# Altium schematic sheet CRSC0002.SchDoc
size A3; PageSetup: Record=PageOptions|CenterHorizontal=True|CenterVertical=True|PrintScale=0.73|XCorrection=1.00|YCorrection=1.00|PrintKind=1|BorderSize=5000000|LeftOffset=0|BottomOffset=0|Orientation=2|PaperLength=2970|PaperWidth=2100|Scale=100|PaperSource=15|PrintQuality=1200|MediaType=1|DitherType=10|PaperKind=A4|PrintScaleMode=1
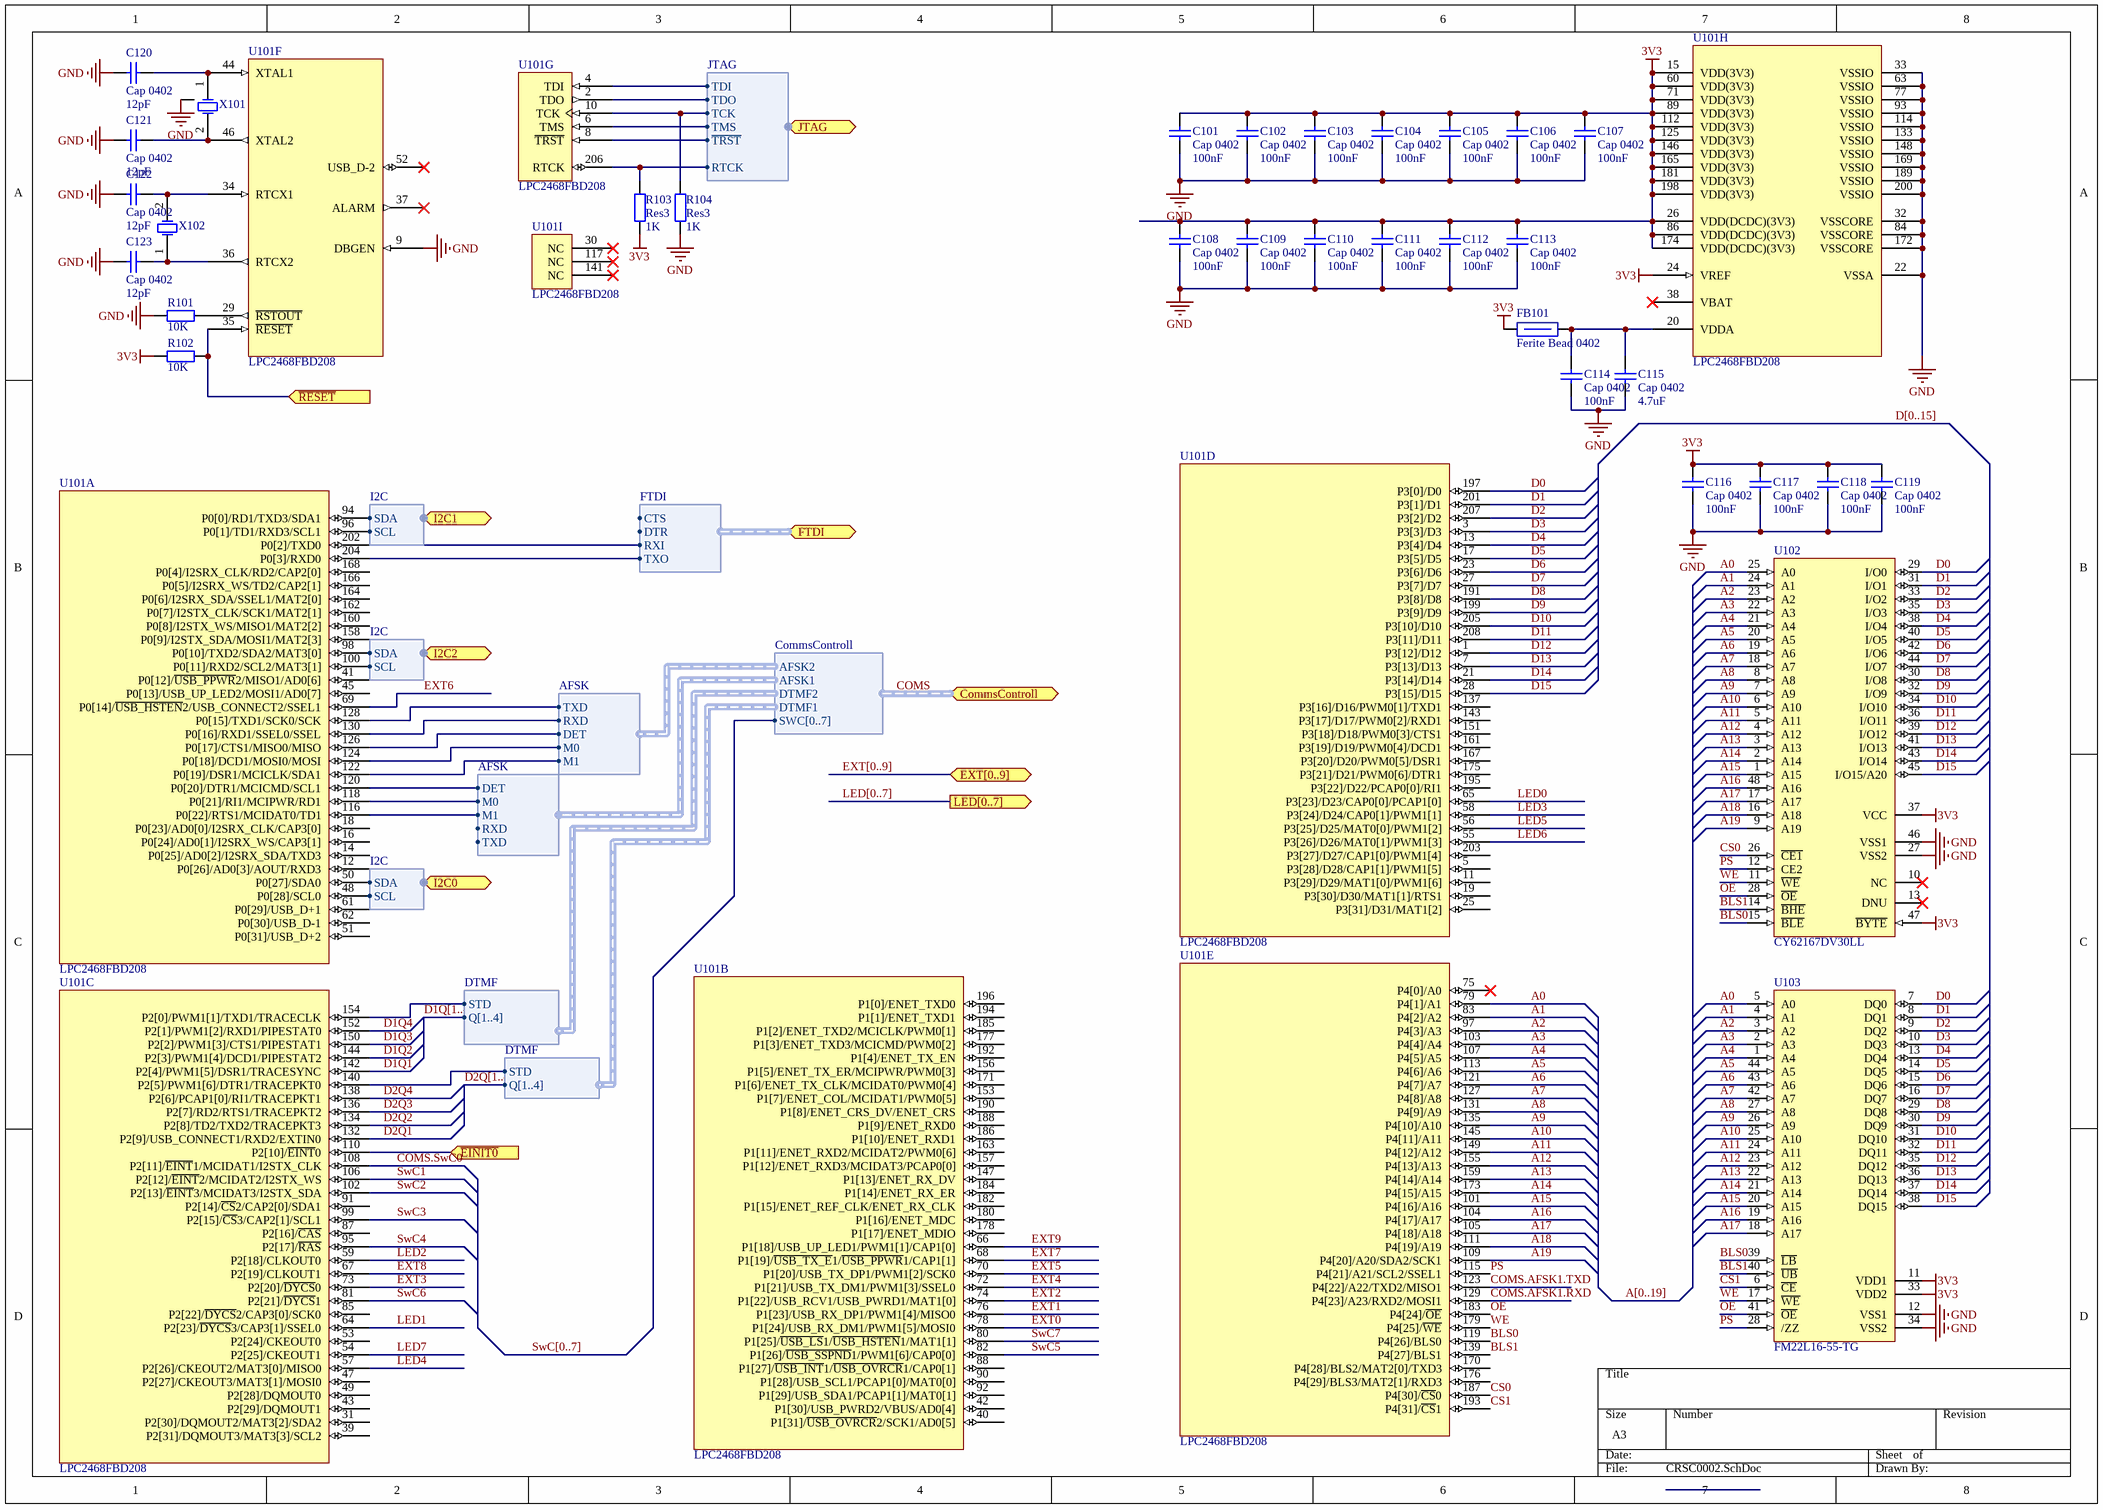
[diagram p0: CRSC0002.SchDoc]

## Parts
C101  Cap 0402  value 100nF  [CAPC1005X06L]
C102  Cap 0402  value 100nF  [CAPC1005X06L]
C103  Cap 0402  value 100nF  [CAPC1005X06L]
C104  Cap 0402  value 100nF  [CAPC1005X06L]
C105  Cap 0402  value 100nF  [CAPC1005X06L]
C106  Cap 0402  value 100nF  [CAPC1005X06L]
C107  Cap 0402  value 100nF  [CAPC1005X06L]
C108  Cap 0402  value 100nF  [CAPC1005X06L]
C109  Cap 0402  value 100nF  [CAPC1005X06L]
C110  Cap 0402  value 100nF  [CAPC1005X06L]
C111  Cap 0402  value 100nF  [CAPC1005X06L]
C112  Cap 0402  value 100nF  [CAPC1005X06L]
C113  Cap 0402  value 100nF  [CAPC1005X06L]
C114  Cap 0402  value 100nF  [CAPC1005X06L]
C115  Cap 0402  value 4.7uF  [CAPC1005X06L]
C116  Cap 0402  value 100nF  [CAPC1005X06L]
C117  Cap 0402  value 100nF  [CAPC1005X06L]
C118  Cap 0402  value 100nF  [CAPC1005X06L]
C119  Cap 0402  value 100nF  [CAPC1005X06L]
C120  Cap 0402  value 12pF  [CAPC1005X06L]
C121  Cap 0402  value 12pF  [CAPC1005X06L]
C122  Cap 0402  value 12pF  [CAPC1005X06L]
C123  Cap 0402  value 12pF  [CAPC1005X06L]
FB101  Ferite Bead 0402  [INDC1005X06L]
R101  value 10K  [RESC1005X06L]  (hidden comment: Res3)
R102  value 10K  [RESC1005X06L]  (hidden comment: Res3)
R103  Res3  value 1K  [RESC1005X06L]
R104  Res3  value 1K  [RESC1005X06L]
U101  LPC2468FBD208  [TSQFP50P3000X3000X160-208L]  (parts A,B,C,D,E,F,G,H,I of 9)
U102  CY62167DV30LL  [TSSOP50P2000X120-48L]
U103  FM22L16-55-TG  [TSOP80P1180X120-44L]
X101  Crystal Oscilator  [7M]  (value not drawn)
X102  Crystal Oscilator  [9H T10]  (value not drawn)

## Ports
CommsControll (harness CommsControll), EXT[0..9] (bidir), FTDI (harness FTDI), I2C0 (harness I2C), I2C1 (harness I2C), I2C2 (harness I2C), JTAG (harness JTAG), LED[0..7] (out), ~{EINIT0} (in), ~{RESET} (in)

## Harnesses
I2C: SDA, SCL
JTAG: TDI, TDO, TCK, TMS, ~{TRST}, RTCK
AFSK: DET, M0, M1, RXD, TXD
DTMF: Q[1..4], STD
CommsControll: AFSK1, AFSK2, DTMF1, DTMF2, SWC[0..7]
FTDI: CTS, DTR, RXI, TXO

## Nets
3V3: C101.2 C102.2 C103.2 C104.2 C105.2 C106.2 C107.2 C108.2 C109.2 C110.2 C111.2 C112.2 C113.2 C116.2 C117.2 C118.2 C119.2 FB101.1 R102.2 R103.2 U101.15(VDD(3V3)) U101.24(VREF) U101.26(VDD(DCDC)(3V3)) U101.60(VDD(3V3)) U101.71(VDD(3V3)) U101.86(VDD(DCDC)(3V3)) U101.89(VDD(3V3)) U101.112(VDD(3V3)) U101.125(VDD(3V3)) U101.146(VDD(3V3)) U101.165(VDD(3V3)) U101.174(VDD(DCDC)(3V3)) U101.181(VDD(3V3)) U101.198(VDD(3V3)) U102.37(VCC) U102.47(~{BYTE}) U103.11(VDD1) U103.33(VDD2)
GND: C101.1 C102.1 C103.1 C104.1 C105.1 C106.1 C107.1 C108.1 C109.1 C110.1 C111.1 C112.1 C113.1 C114.1 C115.1 C116.1 C117.1 C118.1 C119.1 C120.2 C121.1 C122.2 C123.1 R101.2 R104.2 U101.9(DBGEN) U101.22(VSSA) U101.32(VSSCORE) U101.33(VSSIO) U101.63(VSSIO) U101.77(VSSIO) U101.84(VSSCORE) U101.93(VSSIO) U101.114(VSSIO) U101.133(VSSIO) U101.148(VSSIO) U101.169(VSSIO) U101.172(VSSCORE) U101.189(VSSIO) U101.200(VSSIO) U102.27(VSS2) U102.46(VSS1) U103.12(VSS1) U103.34(VSS2) X101.3
A0: U101.79(P4[1]/A1) U102.25(A0) U103.5(A0)
A1: U101.83(P4[2]/A2) U102.24(A1) U103.4(A1)
A2: U101.97(P4[3]/A3) U102.23(A2) U103.3(A2)
A3: U101.103(P4[4]/A4) U102.22(A3) U103.2(A3)
A4: U101.107(P4[5]/A5) U102.21(A4) U103.1(A4)
A5: U101.113(P4[6]/A6) U102.20(A5) U103.44(A5)
A6: U101.121(P4[7]/A7) U102.19(A6) U103.43(A6)
A7: U101.127(P4[8]/A8) U102.18(A7) U103.42(A7)
A8: U101.131(P4[9]/A9) U102.8(A8) U103.27(A8)
A9: U101.135(P4[10]/A10) U102.7(A9) U103.26(A9)
A10: U101.145(P4[11]/A11) U102.6(A10) U103.25(A10)
A11: U101.149(P4[12]/A12) U102.5(A11) U103.24(A11)
A12: U101.155(P4[13]/A13) U102.4(A12) U103.23(A12)
A13: U101.159(P4[14]/A14) U102.3(A13) U103.22(A13)
A14: U101.173(P4[15]/A15) U102.2(A14) U103.21(A14)
A15: U101.101(P4[16]/A16) U102.1(A15) U103.20(A15)
A16: U101.104(P4[17]/A17) U102.48(A16) U103.19(A16)
A17: U101.105(P4[18]/A18) U102.17(A17) U103.18(A17)
A18: U101.111(P4[19]/A19) U102.16(A18)
A19: U101.109(P4[20]/A20/SDA2/SCK1) U102.9(A19)
BLS0: U101.119(P4[26]/BLS0) U102.15(~{BLE}) U103.39(~{LB})
BLS1: U101.139(P4[27]/BLS1) U102.14(~{BHE}) U103.40(~{UB})
COMS.AFSK1.RXD: U101.129(P4[23]/A23/RXD2/MOSI1)
COMS.AFSK1.TXD: U101.123(P4[22]/A22/TXD2/MISO1)
COMS.SwC0: U101.108(P2[11]/~{EINT}1/MCIDAT1/I2STX_CLK)
CS0: U101.187(P4[30]/~{CS}0) U102.26(~{CE1})
CS1: U101.193(P4[31]/~{CS}1) U103.6(~{CE})
D0: U101.197(P3[0]/D0) U102.29(I/O0) U103.7(DQ0)
D1: U101.201(P3[1]/D1) U102.31(I/O1) U103.8(DQ1)
D1Q1: U101.142(P2[4]/PWM1[5]/DSR1/TRACESYNC)
D1Q2: U101.144(P2[3]/PWM1[4]/DCD1/PIPESTAT2)
D1Q3: U101.150(P2[2]/PWM1[3]/CTS1/PIPESTAT1)
D1Q4: U101.152(P2[1]/PWM1[2]/RXD1/PIPESTAT0)
D2: U101.207(P3[2]/D2) U102.33(I/O2) U103.9(DQ2)
D2Q1: U101.132(P2[9]/USB_CONNECT1/RXD2/EXTIN0)
D2Q2: U101.134(P2[8]/TD2/TXD2/TRACEPKT3)
D2Q3: U101.136(P2[7]/RD2/RTS1/TRACEPKT2)
D2Q4: U101.138(P2[6]/PCAP1[0]/RI1/TRACEPKT1)
D3: U101.3(P3[3]/D3) U102.35(I/O3) U103.10(DQ3)
D4: U101.13(P3[4]/D4) U102.38(I/O4) U103.13(DQ4)
D5: U101.17(P3[5]/D5) U102.40(I/O5) U103.14(DQ5)
D6: U101.23(P3[6]/D6) U102.42(I/O6) U103.15(DQ6)
D7: U101.27(P3[7]/D7) U102.44(I/O7) U103.16(DQ7)
D8: U101.191(P3[8]/D8) U102.30(I/O8) U103.29(DQ8)
D9: U101.199(P3[9]/D9) U102.32(I/O9) U103.30(DQ9)
D10: U101.205(P3[10]/D10) U102.34(I/O10) U103.31(DQ10)
D11: U101.208(P3[11]/D11) U102.36(I/O11) U103.32(DQ11)
D12: U101.1(P3[12]/D12) U102.39(I/O12) U103.35(DQ12)
D13: U101.7(P3[13]/D13) U102.41(I/O13) U103.36(DQ13)
D14: U101.21(P3[14]/D14) U102.43(I/O14) U103.37(DQ14)
D15: U101.28(P3[15]/D15) U102.45(I/O15/A20) U103.38(DQ15)
~{EINIT0}: U101.110(P2[10]/~{EINT}0) ; port ~{EINIT0}
EXT0: U101.78(P1[24]/USB_RX_DM1/PWM1[5]/MOSI0)
EXT1: U101.76(P1[23]/USB_RX_DP1/PWM1[4]/MISO0)
EXT2: U101.74(P1[22]/USB_RCV1/USB_PWRD1/MAT1[0])
EXT3: U101.73(P2[20]/~{DYCS}0)
EXT4: U101.72(P1[21]/USB_TX_DM1/PWM1[3]/SSEL0)
EXT5: U101.70(P1[20]/USB_TX_DP1/PWM1[2]/SCK0)
EXT6: U101.69(P0[14]/~{USB_HSTEN}2/USB_CONNECT2/SSEL1)
EXT7: U101.68(P1[19]/~{USB_TX_E}1/~{USB_PPWR}1/CAP1[1])
EXT8: U101.67(P2[19]/CLKOUT1)
EXT9: U101.66(P1[18]/USB_UP_LED1/PWM1[1]/CAP1[0])
LED0: U101.65(P3[23]/D23/CAP0[0]/PCAP1[0])
LED1: U101.64(P2[23]/~{DYCS}3/CAP3[1]/SSEL0)
LED2: U101.59(P2[18]/CLKOUT0)
LED3: U101.58(P3[24]/D24/CAP0[1]/PWM1[1])
LED4: U101.57(P2[26]/CKEOUT2/MAT3[0]/MISO0)
LED5: U101.56(P3[25]/D25/MAT0[0]/PWM1[2])
LED6: U101.55(P3[26]/D26/MAT0[1]/PWM1[3])
LED7: U101.54(P2[25]/CKEOUT1)
OE: U101.183(P4[24]/~{OE}) U102.28(~{OE}) U103.41(~{OE})
PS: U101.115(P4[21]/A21/SCL2/SSEL1) U102.12(CE2) U103.28(/ZZ)
~{RESET}: R102.1 U101.35(~{RESET}) ; port ~{RESET}
SwC1: U101.106(P2[12]/~{EINT}2/MCIDAT2/I2STX_WS)
SwC2: U101.102(P2[13]/~{EINT}3/MCIDAT3/I2STX_SDA)
SwC3: U101.99(P2[15]/~{CS}3/CAP2[1]/SCL1)
SwC4: U101.95(P2[17]/~{RAS})
SwC5: U101.82(P1[26]/~{USB_SSPND}1/PWM1[6]/CAP0[0])
SwC6: U101.81(P2[21]/~{DYCS}1)
SwC7: U101.80(P1[25]/~{USB_LS}1/~{USB_HSTEN}1/MAT1[1])
WE: U101.179(P4[25]/~{WE}) U102.11(~{WE}) U103.17(~{WE})
NetC114_2: C114.2 C115.2 FB101.2 U101.20(VDDA)
NetC120_1: C120.1 U101.44(XTAL1) X101.1(OSC1)
NetC121_2: C121.2 U101.46(XTAL2) X101.2(OSC2)
NetC122_1: C122.1 U101.34(RTCX1) X102.2(OSC2)
NetC123_2: C123.2 U101.36(RTCX2) X102.1(OSC1)
NetR101_1: R101.1 U101.29(~{RSTOUT})
NetR103_1: R103.1 U101.206(RTCK) ; port JTAG.RTCK
NetR104_1: R104.1 U101.10(TCK) ; port JTAG.TCK
NetU101_2: U101.2(TDO) ; port JTAG.TDO
NetU101_4: U101.4(TDI) ; port JTAG.TDI
NetU101_6: U101.6(TMS) ; port JTAG.TMS
NetU101_8: U101.8(~{TRST}) ; port JTAG.~{TRST}
NetU101_48: U101.48(P0[28]/SCL0) ; port I2C0.SCL
NetU101_50: U101.50(P0[27]/SDA0) ; port I2C0.SDA
NetU101_94: U101.94(P0[0]/RD1/TXD3/SDA1) ; port I2C1.SDA
NetU101_96: U101.96(P0[1]/TD1/RXD3/SCL1) ; port I2C1.SCL
NetU101_98: U101.98(P0[10]/TXD2/SDA2/MAT3[0]) ; port I2C2.SDA
NetU101_100: U101.100(P0[11]/RXD2/SCL2/MAT3[1]) ; port I2C2.SCL
NetU101_116: U101.116(P0[22]/RTS1/MCIDAT0/TD1) ; harness AFSK.M1
NetU101_118: U101.118(P0[21]/RI1/MCIPWR/RD1) ; harness AFSK.M0
NetU101_120: U101.120(P0[20]/DTR1/MCICMD/SCL1) ; harness AFSK.DET
NetU101_122: U101.122(P0[19]/DSR1/MCICLK/SDA1) ; harness AFSK.M1
NetU101_124: U101.124(P0[18]/DCD1/MOSI0/MOSI) ; harness AFSK.M0
NetU101_126: U101.126(P0[17]/CTS1/MISO0/MISO) ; harness AFSK.DET
NetU101_128: U101.128(P0[15]/TXD1/SCK0/SCK) ; harness AFSK.TXD
NetU101_130: U101.130(P0[16]/RXD1/SSEL0/SSEL) ; harness AFSK.RXD
NetU101_140: U101.140(P2[5]/PWM1[6]/DTR1/TRACEPKT0) ; harness DTMF.STD
NetU101_154: U101.154(P2[0]/PWM1[1]/TXD1/TRACECLK) ; harness DTMF.STD
NetU101_202: U101.202(P0[2]/TXD0) ; port FTDI.RXI
NetU101_204: U101.204(P0[3]/RXD0) ; port FTDI.TXO

Not connected (* = marked no-connect by the designer): U101 5(P3[28]/D28/CAP1[1]/PWM1[5]) 11(P3[29]/D29/MAT1[0]/PWM1[6]) 12(P0[26]/AD0[3]/AOUT/RXD3) 14(P0[25]/AD0[2]/I2SRX_SDA/TXD3) 16(P0[24]/AD0[1]/I2SRX_WS/CAP3[1]) 18(P0[23]/AD0[0]/I2SRX_CLK/CAP3[0]) 19(P3[30]/D30/MAT1[1]/RTS1) 25(P3[31]/D31/MAT1[2]) 30(NC)* 31(P2[30]/DQMOUT2/MAT3[2]/SDA2) 37(ALARM)* 38(VBAT)* 39(P2[31]/DQMOUT3/MAT3[3]/SCL2) 40(P1[31]/~{USB_OVRCR}2/SCK1/AD0[5]) 41(P0[12]/~{USB_PPWR}2/MISO1/AD0[6]) 42(P1[30]/USB_PWRD2/VBUS/AD0[4]) 43(P2[29]/DQMOUT1) 45(P0[13]/USB_UP_LED2/MOSI1/AD0[7]) 47(P2[27]/CKEOUT3/MAT3[1]/MOSI0) 49(P2[28]/DQMOUT0) 51(P0[31]/USB_D+2) 52(USB_D-2)* 53(P2[24]/CKEOUT0) 61(P0[29]/USB_D+1) 62(P0[30]/USB_D-1) 75(P4[0]/A0)* 85(P2[22]/~{DYCS}2/CAP3[0]/SCK0) 87(P2[16]/~{CAS}) 88(P1[27]/~{USB_INT}1/~{USB_OVRCR}1/CAP0[1]) 90(P1[28]/USB_SCL1/PCAP1[0]/MAT0[0]) 91(P2[14]/~{CS}2/CAP2[0]/SDA1) 92(P1[29]/USB_SDA1/PCAP1[1]/MAT0[1]) 117(NC)* 137(P3[16]/D16/PWM0[1]/TXD1) 141(NC)* 143(P3[17]/D17/PWM0[2]/RXD1) 147(P1[13]/ENET_RX_DV) 151(P3[18]/D18/PWM0[3]/CTS1) 153(P1[7]/ENET_COL/MCIDAT1/PWM0[5]) 156(P1[5]/ENET_TX_ER/MCIPWR/PWM0[3]) 157(P1[12]/ENET_RXD3/MCIDAT3/PCAP0[0]) 158(P0[9]/I2STX_SDA/MOSI1/MAT2[3]) 160(P0[8]/I2STX_WS/MISO1/MAT2[2]) 161(P3[19]/D19/PWM0[4]/DCD1) 162(P0[7]/I2STX_CLK/SCK1/MAT2[1]) 163(P1[11]/ENET_RXD2/MCIDAT2/PWM0[6]) 164(P0[6]/I2SRX_SDA/SSEL1/MAT2[0]) 166(P0[5]/I2SRX_WS/TD2/CAP2[1]) 167(P3[20]/D20/PWM0[5]/DSR1) 168(P0[4]/I2SRX_CLK/RD2/CAP2[0]) 170(P4[28]/BLS2/MAT2[0]/TXD3) 171(P1[6]/ENET_TX_CLK/MCIDAT0/PWM0[4]) 175(P3[21]/D21/PWM0[6]/DTR1) 176(P4[29]/BLS3/MAT2[1]/RXD3) 177(P1[3]/ENET_TXD3/MCICMD/PWM0[2]) 178(P1[17]/ENET_MDIO) 180(P1[16]/ENET_MDC) 182(P1[15]/ENET_REF_CLK/ENET_RX_CLK) 184(P1[14]/ENET_RX_ER) 185(P1[2]/ENET_TXD2/MCICLK/PWM0[1]) 186(P1[10]/ENET_RXD1) 188(P1[9]/ENET_RXD0) 190(P1[8]/ENET_CRS_DV/ENET_CRS) 192(P1[4]/ENET_TX_EN) 194(P1[1]/ENET_TXD1) 195(P3[22]/D22/PCAP0[0]/RI1) 196(P1[0]/ENET_TXD0) 203(P3[27]/D27/CAP1[0]/PWM1[4]); U102 10(NC)* 13(DNU)*

## Buses and harness runs
bus A[0..19]
bus D1Q[1..4]
bus D2Q[1..4]
bus D[0..15]
bus EXT[0..9] = port EXT[0..9]
bus LED[0..7] = port LED[0..7]
bus SwC[0..7]
harness COMS = port CommsControll

## Library data of the parts
C101-C123 = Cap 0402: Capacitor; Published: 8-Jun-2000; LatestRevisionDate: 17-Jul-2002; LatestRevisionNote: Re-released for DXP Platform.; PackageReference: RAD-0.3; Publisher: Altium Limited; PackageDescription: Radial Cap, Thru-Hole; 2 Leads; 0.3 in Pin Spacing
FB101 = FB_0402: Ferite Bead : 0402; Published: 8-Jun-2000; LatestRevisionDate: 29-May-2009; LatestRevisionNote: IPC-7351 Footprint Added.; PackageReference: J1-0603; Publisher: Altium Limited; PackageDescription: Chip Resistor
R101-R104 = Res3: Resistor; Published: 8-Jun-2000; LatestRevisionDate: 29-May-2009; LatestRevisionNote: IPC-7351 Footprint Added.; PackageReference: J1-0603; Publisher: Altium Limited; PackageDescription: Chip Resistor
U101 = LPC2468FBD208: ARM7 16/32-Bit Microcontroller, 512KB Flash, 98KB RAM, 208-Lead LQFP; Code_IEC: 136E30; Published: 17-Aug-2007; DatasheetVersion: rev.01, Jul-2007; PackageVersion: Feb-2003; PackageReference: SOT459-1; Publisher: Altium Limited; PackageDescription: 208-Pin Plastic Low Profile Quad Flat Pack, LQFP208; Code_JEDEC: MS-026; ComponentLink1Description: Manufacturer Link; ComponentLink1URL: http://www.nxp.com/; ComponentLink2Description: Datasheet; ComponentLink2URL: http://www.standardics.nxp.com/products/lpc2000/datasheet/lpc2468.pdf
U102 = CY62167DV30LL: 16-Mbit (1M x 16) Static RAM; ColumnAddress: A0-A9; Publisher: Altium Limited; ComponentLink1Description: Manufacturer Link; ComponentLink2Description: Datasheet
U103 = FM22L16-55-TG: FRAM, 2MB, 3V, 60NS, 44TSOP2; ColumnAddress: A0-A9; LatestRevisionDate: 13-Apr-2006; DatasheetVersion: rev1.1, Feb-2004; PackageReference: TSOP2-44_M; PackageDescription: 44-Pin Small Outline Package 0.8 mm Pitch; ComponentLink1Description: Manufacturer Link; ComponentLink2Description: Datasheet
X101 = C.O. 4pins: Crystal Oscillator; Value: 12.000MHz; Published: 8-Jun-2000; LatestRevisionDate: 17-Jul-2002; LatestRevisionNote: Re-released for DXP Platform.; PackageReference: R38; Publisher: Altium Limited
X102 = C.O. 2pins: Crystal Oscillator; Value: 12.000MHz; Published: 8-Jun-2000; LatestRevisionDate: 17-Jul-2002; LatestRevisionNote: Re-released for DXP Platform.; PackageReference: R38; Publisher: Altium Limited